# EAGLE design eeZeePower (EAGLE 6.4)
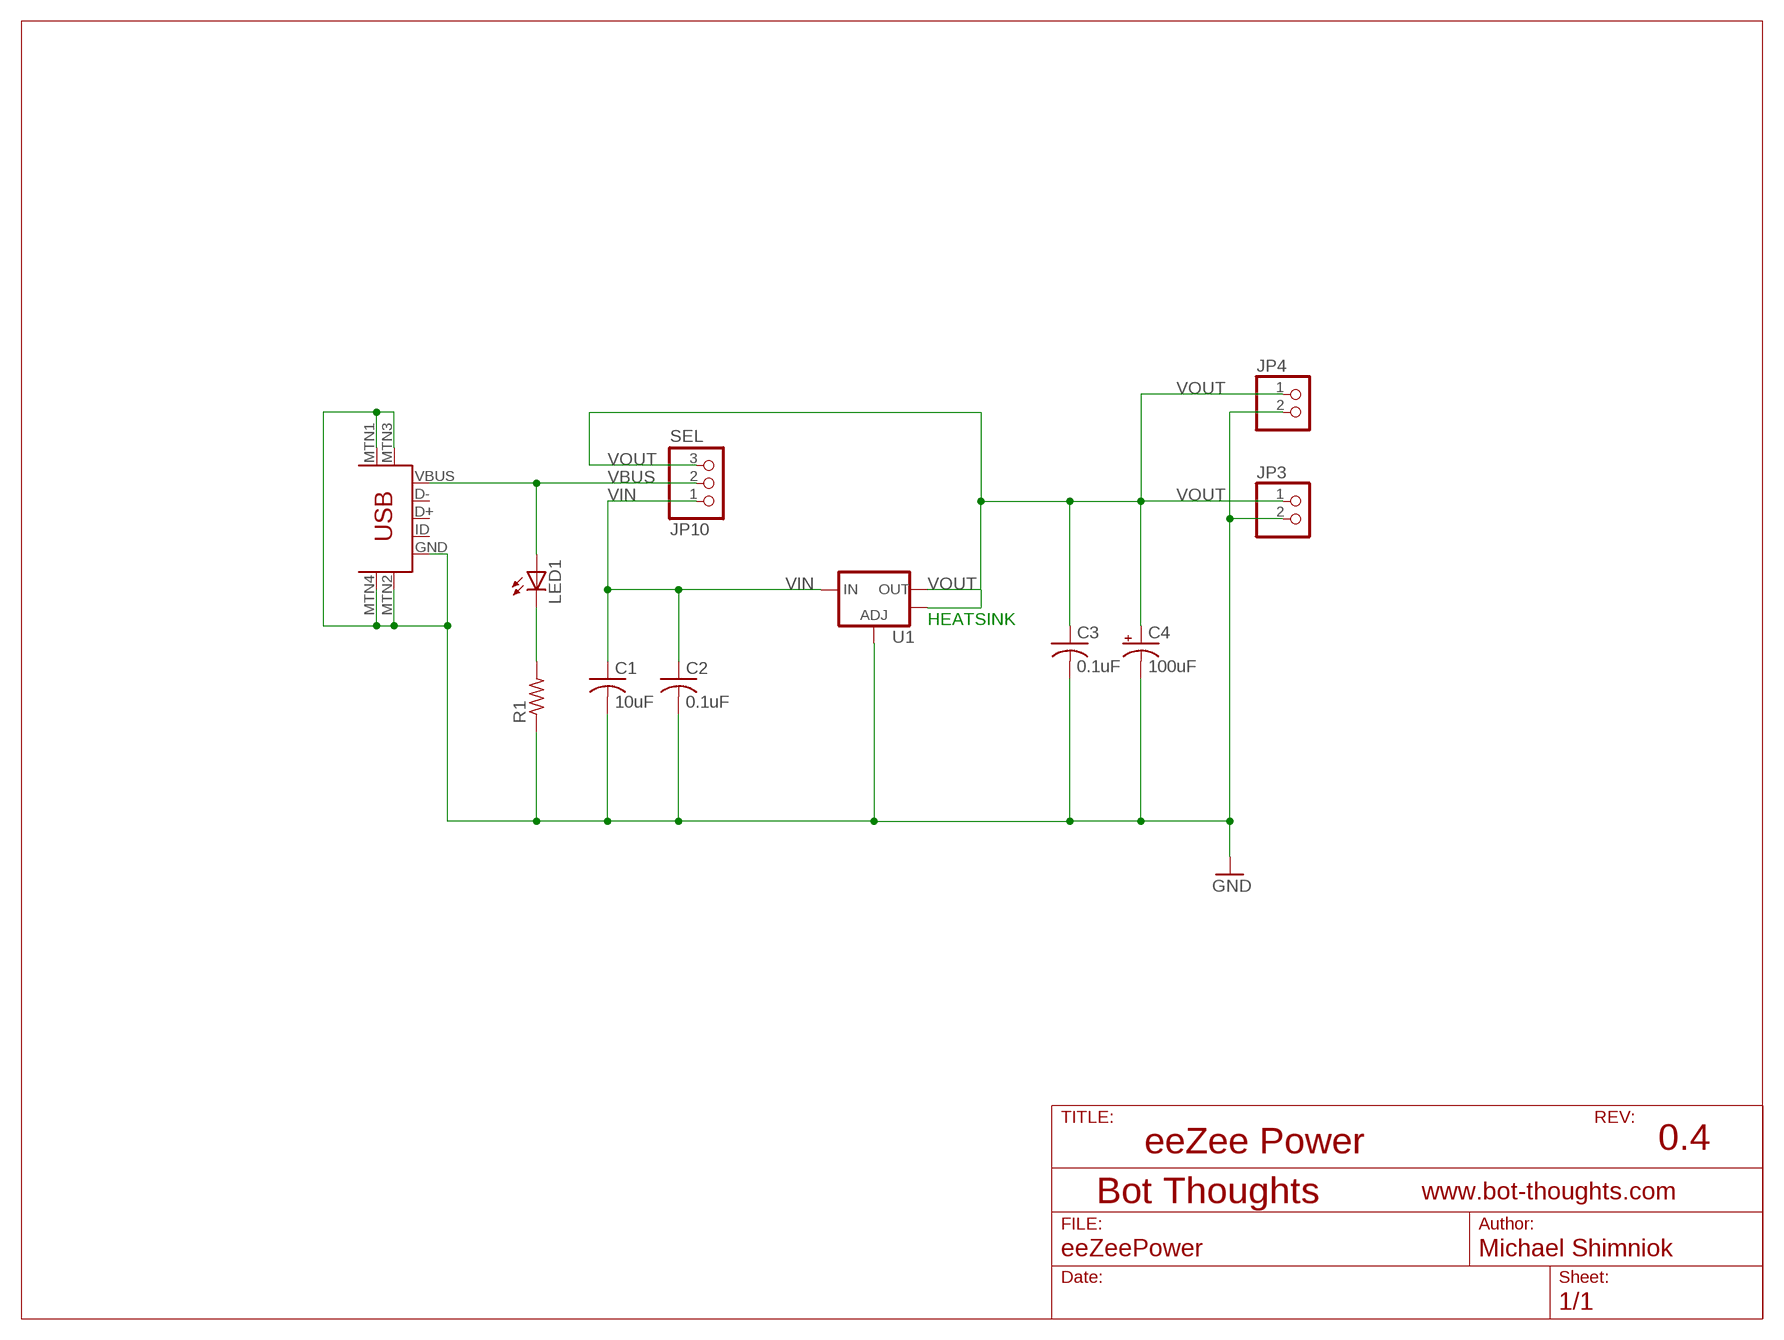
[diagram p0: schematic, sheet 1]

## Parts
C1  10uF  C-USC1206  [C1206]
C2  0.1uF  C-USC0603  [C0603]
C3  0.1uF  C-USC0603  [C0603]
C4  100uF  CPOL-USSMCB  [SMC_B]
JP3  PINHD-1X02_2.54-S  [1X02-S]
JP4  PINHD-1X02_2.54-S  [1X02-S]
JP10  SEL  PINHD-1X03_2.54-S  [1X03-S]
LED1  LEDCHIPLED_1206  [CHIPLED_1206]
R1  R-US_R0603  [R0603]
U1  V_REG_LM1117SOT223  [SOT223]
U$1  USB-MINIB-5PIN  [USB-MINIB]

## Nets
GND: C1.2 C2.2 C3.2 C4.- JP3.2 JP4.2 R1.1 U1.1(ADJ) U$1.GND U$1.MTN1(MTN2) U$1.MTN2(MTN3) U$1.MTN3(MTN1) U$1.MTN4
N$5: LED1.C R1.2
VBUS: JP10.2 LED1.A U$1.VBUS
VIN: C1.1 C2.1 JP10.1 U1.3(IN)
VOUT: C3.1 C4.+ JP3.1 JP4.1 JP10.3 U1.2(OUT) U1.4(OUT)
Unconnected: U$1.D+ U$1.D- U$1.ID

## Notes on the sheet
- HEATSINK
- eeZee Power | 0.4

## Library data of the parts
C1-C3 = rcl:C-US: CAPACITOR, American symbol
C4 = rcl:CPOL-US: POLARIZED CAPACITOR, American symbol
JP3 JP4 = pinhead-2:PINHD-1X02: PIN HEADER
JP10 = pinhead-2:PINHD-1X03: PIN HEADER
LED1 = led:LED: LED OSRAM: - CHIPLED LG R971, LG N971, LY N971, LG Q971, LY Q971, LO R971, LY R971 LH N974, LH R974 LS Q976, LO Q976, LY Q976 LO Q996 - Hyper CHIPLED LW Q18S LB Q993, LB Q99A, LB R99A - SideLED LS A670, LO A670, LY A670, LG A670, LP A670 LB A673, LV A673, LT A673, LW A673 LH A674 LY A675 LS A676, LA A676, LO A676, LY A676, LW A676 LS A679, LY A679, LG A679 - Hyper Micro SIDELED® LS Y876, LA Y876, LO Y876, LY Y876 LT Y87S - SmartLED LW L88C, LW L88S LB L89C, LB L89S, LG L890 LS L89K, LO L89K, LY L89K LS L896, LA L896, LO L896, LY L896 - TOPLED LS T670, LO T670, LY T670, LG T670, LP T670 LSG T670, LSP T670, LSY T670, LOP T670, LYG T670 LG T671, LOG T671, LSG T671 LB T673, LV T673, LT T673, LW T673 LH T674 LS T676, LA T676, LO T676, LY T676, LB T676, LH T676, LSB T676, LW T676 LB T67C, LV T67C, LT T67C, LS T67K, LO T67K, LY T67K, LW E67C LS E67B, LA E67B, LO E67B, LY E67B, LB E67C, LV E67C, LT E67C LW T67C LS T679, LY T679, LG T679 LS T770, LO T770, LY T770, LG T770, LP T770 LB T773, LV T773, LT T773, LW T773 LH T774 LS E675, LA E675, LY E675, LS T675 LS T776, LA T776, LO T776, LY T776, LB T776 LHGB T686 LT T68C, LB T68C - Hyper Mini TOPLED® LB M676 - Mini TOPLED Santana® LG M470 LS M47K, LO M47K, LY M47K Source: http://www.osram.convergy.de LUXEON: - LUMILED® LXK2-PW12-R00, LXK2-PW12-S00, LXK2-PW14-U00, LXK2-PW14-V00 LXK2-PM12-R00, LXK2-PM12-S00, LXK2-PM14-U00 LXK2-PE12-Q00, LXK2-PE12-R00, LXK2-PE12-S00, LXK2-PE14-T00, LXK2-PE14-U00 LXK2-PB12-K00, LXK2-PB12-L00, LXK2-PB12-M00, LXK2-PB14-N00, LXK2-PB14-P00, LXK2-PB14-Q00 LXK2-PR12-L00, LXK2-PR12-M00, LXK2-PR14-Q00, LXK2-PR14-R00 LXK2-PD12-Q00, LXK2-PD12-R00, LXK2-PD12-S00 LXK2-PH12-R00, LXK2-PH12-S00 LXK2-PL12-P00, LXK2-PL12-Q00, LXK2-PL12-R00 Source: www.luxeon.com KINGBRIGHT: KA-3528ASYC Source: www.kingbright.com
R1 = resistor:R-US_: RESISTOR, American symbol
U1 = SparkFun:V_REG_LM1117: Voltage Regulator LM1117 Standard adjustable voltage regulator but in SMD form. Spark Fun Electronics SKU : COM-00595
U$1 = SparkFun:USB-MINIB: Mini-USB "B" connector with 5th pin broken out. Created new symbol breaking out 5th "ID" pin in mini/micro USB connector spec. See: http://en.wikipedia.org/wiki/Mini_usb#Cables. Uses same footprint as 4-pin symbol. Also added pins to connect to mounting / shield pads if required (probably not generally needed as signals aren't shielded once they leave the connector).

## Board
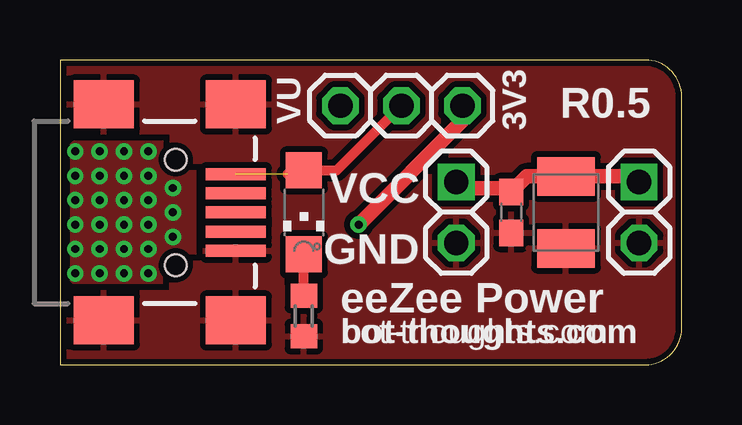
[diagram p1: board, top side]
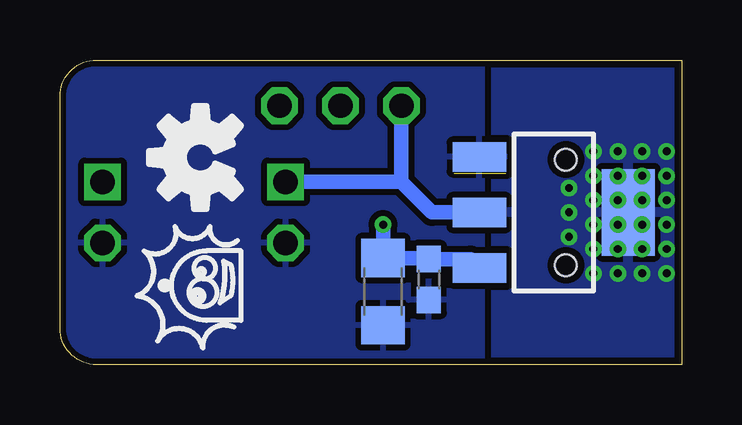
[diagram p2: board, bottom side, seen from below]

Size 25.91 x 12.7 mm. Coordinates in mm from the lower left corner, seen from the top.
Outline: 0,0 24.38,0 arc90 25.91,1.52 25.91,11.18 arc90 24.38,12.7 0,12.7 0,0
Copper layers (1*16): Top 0.0356mm / dielectric 1.5011mm / Bottom 0.0356mm
Design rules "LaenPCBOrder *": minimum track width 6mil, minimum drill 13mil, track to track 10mil, track to pad 10mil, pad to pad 10mil, via to via 10mil, smd to smd 8mil, copper to edge 10mil, drill to drill 10mil, minimum pad ring 7mil, minimum via ring 7mil, stop-mask expansion 3mil, vias tented up to drill 20mil, thermal gap 10mil

### Footprints (pad centres in the part's own frame; a part is rotated, then mirrored left to right if it is on the bottom)
C1206 = smd 1.6 x 1.8: 1 -1.4,0; 2 1.4,0
C0603 = smd 1.1 x 1: 1 -0.85,0; 2 0.85,0
SMC_B = smd 1.6 x 2.4: + -1.5,0; - 1.5,0
1X02-S = drill 1.016 square: 1 -1.27,0 | drill 1.016 octagon: 2 1.27,0
1X03-S = drill 1.016 octagon: 1 -2.54,0; 2 0,0; 3 2.54,0
CHIPLED_1206 = smd 1.5 x 1.5: A 0,-1.75; C 0,1.75
R0603 = smd 1 x 1.1: 1 -0.85,0; 2 0.85,0
SOT223 = smd 1.219 x 2.235: 1 -2.311,-3.099; 2 0,-3.099; 3 2.311,-3.099 | smd 3.6 x 2.2: 4 0,3.099
USB-MINIB = smd 2.5 x 0.5: D+ 2.5,0; D- 2.5,0.8; GND 2.5,-1.6; ID 2.5,-0.8; VBUS 2.5,1.6 | smd 2.5 x 2: MTN1 -3,4.5; MTN2 2.5,4.5; MTN3 -3,-4.5; MTN4 2.5,-4.5 | hole 0.9: 0,2.2; 0,-2.2

### Placement (x,y rotation side)
C1  12.45,3.05 270 bottom
C2  10.54,3.56 270 bottom
C3  18.8,6.35 270 top
C4  21.08,6.35 270 top
JP3  16.51,6.35 270 top
JP4  24.13,6.35 270 top
JP10  14.22,10.79 180 top
LED1  10.16,6.35 180 top
R1  10.16,2.03 90 top
U1  5.33,6.35 270 bottom
U$1  4.83,6.35 0 top

### Tracks (layer width: path | path; a pad name or v marks a point on that pad's centre or on a via)
GND
  pour Top (rank 3): 0,12.7 24.38,12.7 arc-90 25.91,11.18 25.91,1.52 arc-90 24.38,0 0,0
  pour Bottom (rank 2): 0,12.7 24.38,12.7 arc-90 25.91,11.18 25.91,1.52 arc-90 24.38,0 0,0
N$5
  Top 0.406: R1.2 LED1.C
VBUS  (1 unrouted)
  Top 0.406: 9.48,7.95 LED1.A 11.53,8.1 JP10.2
VIN  (via drill 0.33)
  Top 0.61: v12.45,5.84 16.76,10.16 JP10.1
  Bottom 0.61: v12.45,5.84 C1.1 10.58,4.45 C2.1 8.8,4.41 U1.3
VOUT  (via drill 0.33)
  Top 0.61: JP3.1 16.76,7.37 18.71,7.37 C3.1 19.45,7.85 C4.+ 23.9,7.85 JP4.1
  Bottom 0.61: U1.2 10.41,6.35 11.68,7.62 | 11.68,7.62 JP10.3 | 11.68,7.62 JP3.1
  other vias: 1.65,8.89 1.65,7.87 0.64,6.86 3.68,6.86 0.64,7.87 0.64,8.89 1.65,6.86 3.68,7.87 1.65,3.81 0.64,3.81 2.67,7.87 2.67,6.86 2.67,3.81 2.67,8.89 3.68,8.89 4.7,6.35 4.7,5.33 2.67,5.84 1.65,5.84 0.64,5.84 3.68,5.84 2.67,4.83 1.65,4.83 0.64,4.83 3.68,3.81 3.68,4.83 4.7,7.37
  pour Bottom (isolate 0.305): 0.13,12.45 7.75,12.45 7.75,0.25 0.13,0.25
  pour Top (isolate 0.254): 0.64,9.14 5.46,9.14 5.46,3.56 0.64,3.56

### Text on the board
tPlace: R0.5 | bot-thoughts.com
tValues: 3V3 | VU | VCC | GND | eeZee Power
tsilk: 3V3 | VU | R0.5 | VCC | GND | eeZee Power | bot-thoughts.com